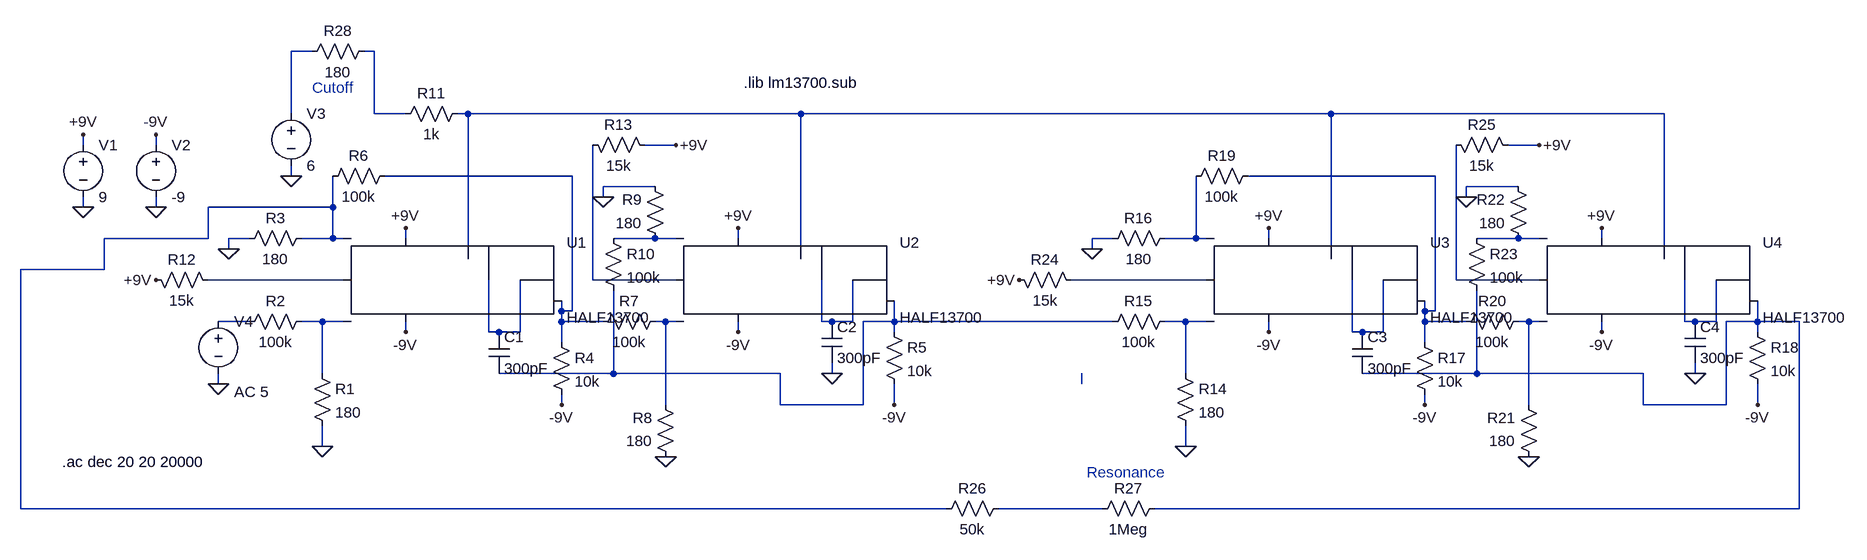
[diagram p0: schematic LM137004PoleFilterWithResonance.asc]
LM137004PoleFilterWithResonance.asc, the LTspice schematic file:
Version 4
SHEET 1 2220 680
WIRE -96 -192 -128 -192
WIRE 0 -192 -16 -192
WIRE -128 -96 -128 -192
WIRE 0 -96 0 -192
WIRE 48 -96 0 -96
WIRE 144 -96 128 -96
WIRE 656 -96 144 -96
WIRE 1472 -96 656 -96
WIRE 1984 -96 1472 -96
WIRE -448 -48 -448 -64
WIRE -336 -48 -336 -64
WIRE 464 -48 416 -48
WIRE 1792 -48 1744 -48
WIRE -128 0 -128 -16
WIRE 304 0 16 0
WIRE 1632 0 1344 0
WIRE 432 16 352 16
WIRE 1760 16 1680 16
WIRE 352 32 352 16
WIRE 1680 32 1680 16
WIRE -448 48 -448 32
WIRE -336 48 -336 32
WIRE -64 48 -64 0
WIRE -64 48 -256 48
WIRE -256 96 -256 48
WIRE -256 96 -416 96
WIRE -192 96 -224 96
WIRE -64 96 -64 48
WIRE -64 96 -112 96
WIRE -48 96 -64 96
WIRE 48 96 48 80
WIRE 432 96 368 96
WIRE 464 96 432 96
WIRE 560 96 560 80
WIRE 1136 96 1104 96
WIRE 1264 96 1264 0
WIRE 1264 96 1216 96
WIRE 1280 96 1264 96
WIRE 1376 96 1376 80
WIRE 1760 96 1696 96
WIRE 1792 96 1760 96
WIRE 1888 96 1888 80
WIRE -224 112 -224 96
WIRE 1104 112 1104 96
WIRE 144 128 144 -96
WIRE 656 128 656 -96
WIRE 1472 128 1472 -96
WIRE 1984 128 1984 -96
WIRE -416 144 -416 96
WIRE -416 144 -544 144
WIRE -48 160 -256 160
WIRE 336 160 336 -48
WIRE 464 160 336 160
WIRE 1280 160 1072 160
WIRE 1664 160 1664 -48
WIRE 1792 160 1664 160
WIRE 288 208 288 192
WIRE 304 208 304 0
WIRE 304 208 288 208
WIRE 1616 208 1616 192
WIRE 1632 208 1632 0
WIRE 1632 208 1616 208
WIRE -192 224 -240 224
WIRE -80 224 -112 224
WIRE -48 224 -80 224
WIRE 288 224 288 208
WIRE 352 224 288 224
WIRE 448 224 432 224
WIRE 464 224 448 224
WIRE 688 224 688 160
WIRE 704 224 688 224
WIRE 736 224 736 160
WIRE 736 224 704 224
WIRE 800 224 800 192
WIRE 800 224 752 224
WIRE 1136 224 800 224
WIRE 1248 224 1216 224
WIRE 1280 224 1248 224
WIRE 1616 224 1616 208
WIRE 1680 224 1616 224
WIRE 1776 224 1760 224
WIRE 1792 224 1776 224
WIRE 2016 224 2016 160
WIRE 2032 224 2016 224
WIRE 2064 224 2064 160
WIRE 2064 224 2032 224
WIRE 2128 224 2128 192
WIRE 2128 224 2080 224
WIRE 2192 224 2128 224
WIRE 48 240 48 224
WIRE 176 240 176 160
WIRE 192 240 176 240
WIRE 224 240 224 160
WIRE 224 240 192 240
WIRE 560 240 560 224
WIRE 800 240 800 224
WIRE 1376 240 1376 224
WIRE 1504 240 1504 160
WIRE 1520 240 1504 240
WIRE 1552 240 1552 160
WIRE 1552 240 1520 240
WIRE 1888 240 1888 224
WIRE 2128 240 2128 224
WIRE 288 256 288 224
WIRE 1616 256 1616 224
WIRE -80 304 -80 224
WIRE 368 304 368 176
WIRE 368 304 192 304
WIRE 624 304 368 304
WIRE 704 304 704 288
WIRE 1248 304 1248 224
WIRE 1696 304 1696 176
WIRE 1696 304 1520 304
WIRE 1952 304 1696 304
WIRE 2032 304 2032 288
WIRE -240 320 -240 304
WIRE 1088 320 1088 304
WIRE 288 352 288 336
WIRE 448 352 448 224
WIRE 624 352 624 304
WIRE 752 352 752 224
WIRE 752 352 624 352
WIRE 800 352 800 320
WIRE 1616 352 1616 336
WIRE 1776 352 1776 224
WIRE 1952 352 1952 304
WIRE 2080 352 2080 224
WIRE 2080 352 1952 352
WIRE 2128 352 2128 320
WIRE -80 416 -80 384
WIRE 1248 416 1248 384
WIRE -544 512 -544 144
WIRE 880 512 -544 512
WIRE 1120 512 960 512
WIRE 2192 512 2192 224
WIRE 2192 512 1200 512
FLAG -448 48 0
FLAG -336 48 0
FLAG -448 -64 +9V
FLAG 48 80 +9V
FLAG 560 80 +9V
FLAG -336 -64 -9V
FLAG 48 240 -9V
FLAG 560 240 -9V
FLAG -80 416 0
FLAG -224 112 0
FLAG 288 352 -9V
FLAG 800 352 -9V
FLAG 704 304 0
FLAG 448 432 0
FLAG 352 32 0
FLAG -128 0 0
FLAG -240 320 0
FLAG 464 -48 +9V
FLAG -336 160 +9V
FLAG 1376 80 +9V
FLAG 1888 80 +9V
FLAG 1376 240 -9V
FLAG 1888 240 -9V
FLAG 1248 416 0
FLAG 1104 112 0
FLAG 1616 352 -9V
FLAG 2128 352 -9V
FLAG 2032 304 0
FLAG 1776 432 0
FLAG 1680 32 0
FLAG 1792 -48 +9V
FLAG 992 160 +9V
SYMBOL LM13700 16 80 R0
SYMATTR InstName U1
SYMBOL LM13700 528 80 R0
SYMATTR InstName U2
SYMBOL voltage -448 -64 R0
WINDOW 123 0 0 Left 0
WINDOW 39 0 0 Left 0
SYMATTR InstName V1
SYMATTR Value 9
SYMBOL voltage -336 -64 R0
WINDOW 123 0 0 Left 0
WINDOW 39 0 0 Left 0
SYMATTR InstName V2
SYMATTR Value -9
SYMBOL res -96 288 R0
SYMATTR InstName R1
SYMATTR Value 180
SYMBOL res -96 208 R90
WINDOW 0 0 56 VBottom 2
WINDOW 3 32 56 VTop 2
SYMATTR InstName R2
SYMATTR Value 100k
SYMBOL res -96 80 R90
WINDOW 0 0 56 VBottom 2
WINDOW 3 32 56 VTop 2
SYMATTR InstName R3
SYMATTR Value 180
SYMBOL res 272 240 R0
SYMATTR InstName R4
SYMATTR Value 10k
SYMBOL res 784 224 R0
SYMATTR InstName R5
SYMATTR Value 10k
SYMBOL cap 176 240 R0
SYMATTR InstName C1
SYMATTR Value 300pF
SYMBOL cap 688 224 R0
SYMATTR InstName C2
SYMATTR Value 300pF
SYMBOL res 32 -16 R90
WINDOW 0 0 56 VBottom 2
WINDOW 3 32 56 VTop 2
SYMATTR InstName R6
SYMATTR Value 100k
SYMBOL res 448 208 R90
WINDOW 0 0 56 VBottom 2
WINDOW 3 32 56 VTop 2
SYMATTR InstName R7
SYMATTR Value 100k
SYMBOL res 464 448 R180
WINDOW 0 36 76 Left 2
WINDOW 3 36 40 Left 2
SYMATTR InstName R8
SYMATTR Value 180
SYMBOL res 448 112 R180
WINDOW 0 36 76 Left 2
WINDOW 3 36 40 Left 2
SYMATTR InstName R9
SYMATTR Value 180
SYMBOL res 352 80 R0
SYMATTR InstName R10
SYMATTR Value 100k
SYMBOL res 144 -112 R90
WINDOW 0 0 56 VBottom 2
WINDOW 3 32 56 VTop 2
SYMATTR InstName R11
SYMATTR Value 1k
SYMBOL voltage -128 -112 R0
WINDOW 123 0 0 Left 0
WINDOW 39 0 0 Left 0
SYMATTR InstName V3
SYMATTR Value 6
SYMBOL voltage -240 208 R0
WINDOW 123 24 124 Left 2
WINDOW 39 0 0 Left 0
SYMATTR Value2 AC 5
SYMATTR InstName V4
SYMATTR Value ""
SYMBOL res -352 144 M90
WINDOW 0 0 56 VBottom 2
WINDOW 3 32 56 VTop 2
SYMATTR InstName R12
SYMATTR Value 15k
SYMBOL res 320 -64 M90
WINDOW 0 0 56 VBottom 2
WINDOW 3 32 56 VTop 2
SYMATTR InstName R13
SYMATTR Value 15k
SYMBOL LM13700 1344 80 R0
SYMATTR InstName U3
SYMBOL LM13700 1856 80 R0
SYMATTR InstName U4
SYMBOL res 1232 288 R0
SYMATTR InstName R14
SYMATTR Value 180
SYMBOL res 1232 208 R90
WINDOW 0 0 56 VBottom 2
WINDOW 3 32 56 VTop 2
SYMATTR InstName R15
SYMATTR Value 100k
SYMBOL res 1232 80 R90
WINDOW 0 0 56 VBottom 2
WINDOW 3 32 56 VTop 2
SYMATTR InstName R16
SYMATTR Value 180
SYMBOL res 1600 240 R0
SYMATTR InstName R17
SYMATTR Value 10k
SYMBOL res 2112 224 R0
SYMATTR InstName R18
SYMATTR Value 10k
SYMBOL cap 1504 240 R0
SYMATTR InstName C3
SYMATTR Value 300pF
SYMBOL cap 2016 224 R0
SYMATTR InstName C4
SYMATTR Value 300pF
SYMBOL res 1360 -16 R90
WINDOW 0 0 56 VBottom 2
WINDOW 3 32 56 VTop 2
SYMATTR InstName R19
SYMATTR Value 100k
SYMBOL res 1776 208 R90
WINDOW 0 0 56 VBottom 2
WINDOW 3 32 56 VTop 2
SYMATTR InstName R20
SYMATTR Value 100k
SYMBOL res 1792 448 R180
WINDOW 0 36 76 Left 2
WINDOW 3 36 40 Left 2
SYMATTR InstName R21
SYMATTR Value 180
SYMBOL res 1776 112 R180
WINDOW 0 36 76 Left 2
WINDOW 3 36 40 Left 2
SYMATTR InstName R22
SYMATTR Value 180
SYMBOL res 1680 80 R0
SYMATTR InstName R23
SYMATTR Value 100k
SYMBOL res 1648 -64 M90
WINDOW 0 0 56 VBottom 2
WINDOW 3 32 56 VTop 2
SYMATTR InstName R25
SYMATTR Value 15k
SYMBOL res 976 144 M90
WINDOW 0 0 56 VBottom 2
WINDOW 3 32 56 VTop 2
SYMATTR InstName R24
SYMATTR Value 15k
SYMBOL res 976 496 R90
WINDOW 0 0 56 VBottom 2
WINDOW 3 32 56 VTop 2
SYMATTR InstName R26
SYMATTR Value 50k
SYMBOL res 1216 496 R90
WINDOW 0 0 56 VBottom 2
WINDOW 3 32 56 VTop 2
SYMATTR InstName R27
SYMATTR Value 1Meg
SYMBOL res 0 -208 R90
WINDOW 0 0 56 VBottom 2
WINDOW 3 32 56 VTop 2
SYMATTR InstName R28
SYMATTR Value 180
TEXT 568 -144 Left 2 !.lib lm13700.sub
TEXT -480 440 Left 2 !.ac dec 20 20 20000
TEXT -96 -136 Left 2 ;Cutoff
TEXT 1096 456 Left 2 ;Resonance

The netlist it stands for:
* LM137004PoleFilterWithResonance.asc
XU1 N010 N015 N006 N003 N023 +9V -9V N023 N004 HALF13700
XU2 N011 N016 N007 N003 N017 +9V -9V N017 N018 HALF13700
V1 +9V 0 9
V2 -9V 0 -9
R1 N015 0 180
R2 N015 N014 100k
R3 N006 0 180
R4 N004 -9V 10k
R5 N018 -9V 10k
C1 N023 N018 300pF
C2 N017 0 300pF
R6 N004 N006 100k
R7 N016 N004 100k
R8 0 N016 180
R9 N007 0 180
R10 N007 N018 100k
R11 N003 N002 1k
V3 N001 0 6
V4 N014 0 AC 5
R12 +9V N010 15k
R13 N011 +9V 15k
XU3 N012 N019 N008 N003 N024 +9V -9V N024 N005 HALF13700
XU4 N013 N020 N009 N003 N021 +9V -9V N021 N022 HALF13700
R14 N019 0 180
R15 N019 N018 100k
R16 N008 0 180
R17 N005 -9V 10k
R18 N022 -9V 10k
C3 N024 N022 300pF
C4 N021 0 300pF
R19 N005 N008 100k
R20 N020 N005 100k
R21 0 N020 180
R22 N009 0 180
R23 N009 N022 100k
R25 N013 +9V 15k
R24 +9V N012 15k
R26 N026 N006 50k
R27 N022 N026 1Meg
R28 N002 N001 180
.lib lm13700.sub
.ac dec 20 20 20000
* Cutoff
* Resonance
.backanno
.end